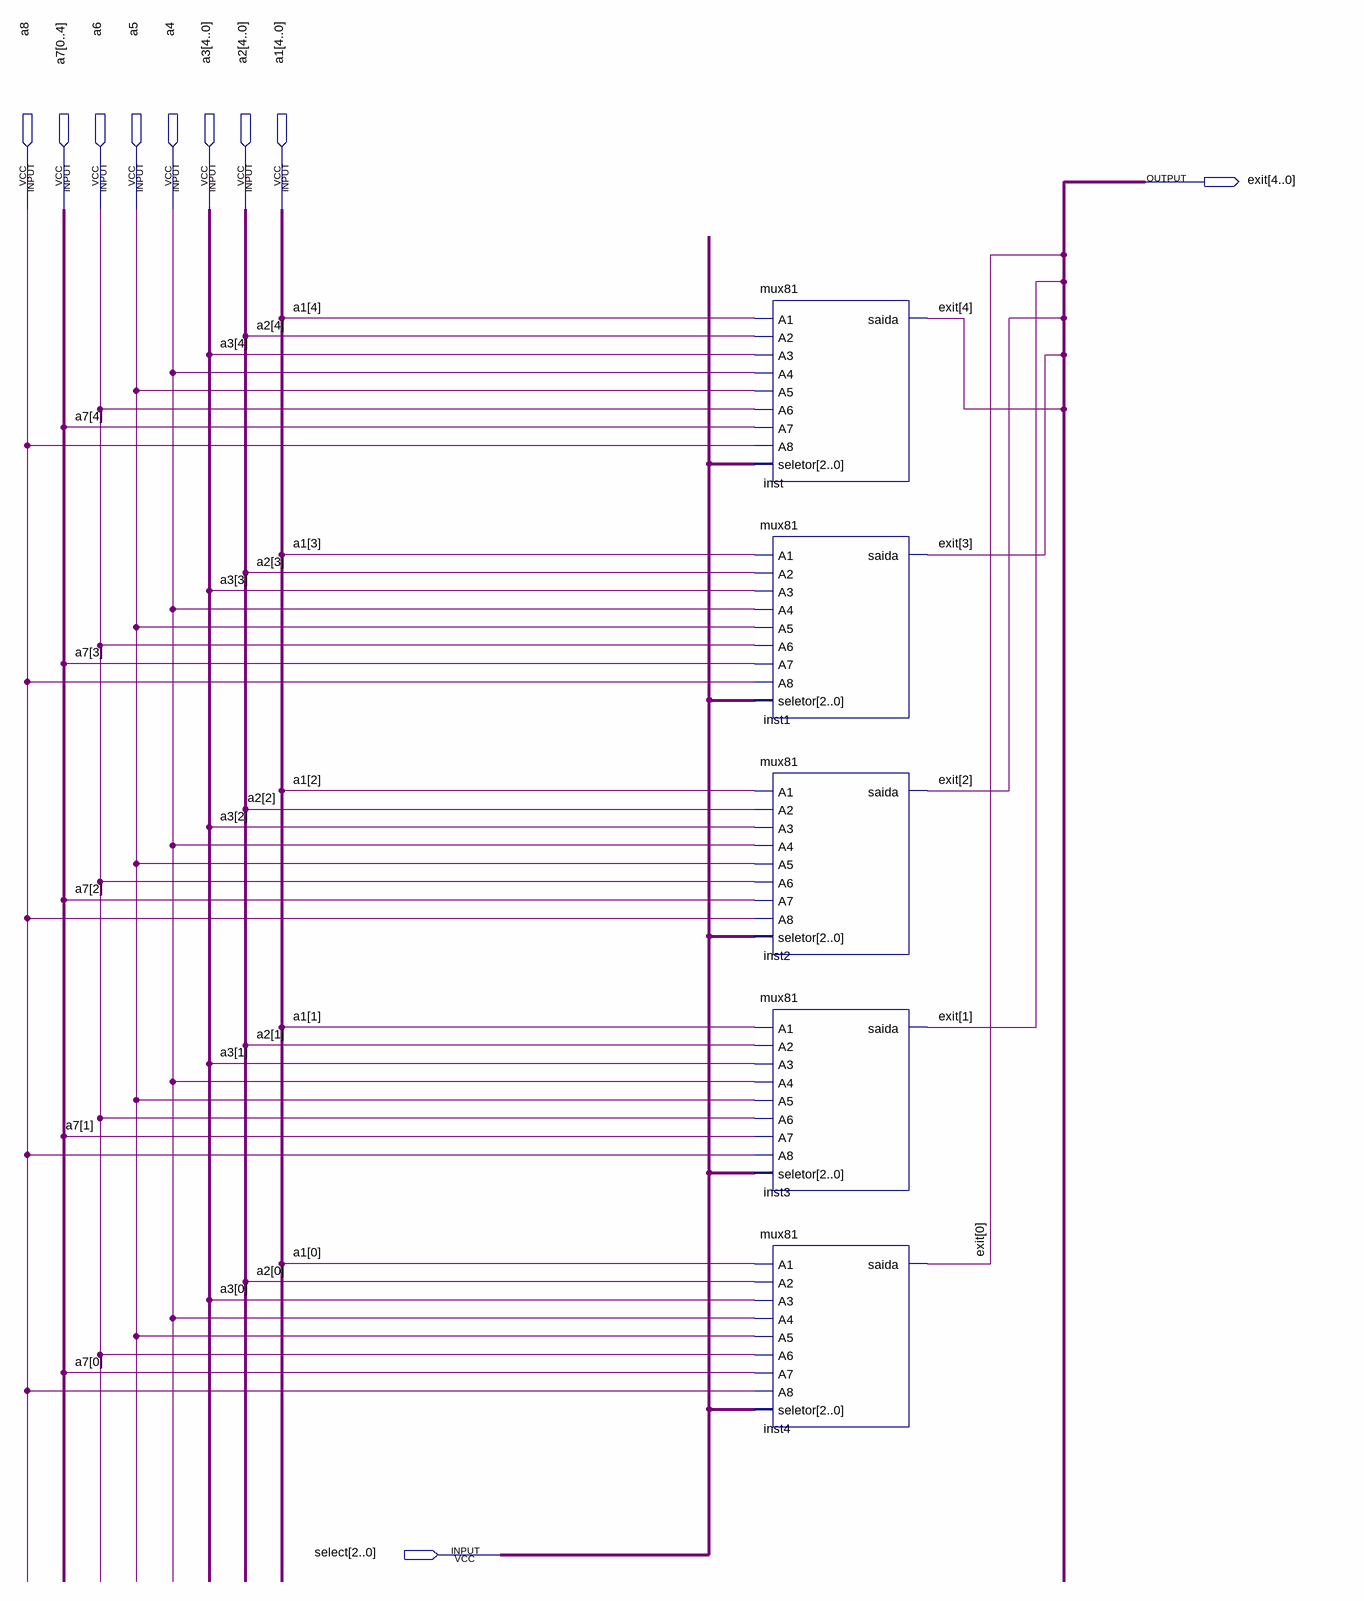
[diagram p0: schematic sheet]
// Quartus schematic mux815bit.bdf as structural Verilog: 5 symbols, 10 pins
module mux815bit (
  input  a8,
  input  [0:4] a7,
  input  a6,
  input  a5,
  input  a4,
  input  [4:0] a3,
  input  [4:0] a2,
  input  [4:0] a1,
  input  [2:0] select,
  output [4:0] exit
);

  mux81 inst (
    .A1(a1[4]), .A2(a2[4]), .A3(a3[4]), .A4(a4), .A5(a5), .A6(a6), .A7(a7[4]), .A8(a8), .seletor(select),
    .saida(exit[4]));
  mux81 inst1 (
    .A1(a1[3]), .A2(a2[3]), .A3(a3[3]), .A4(a4), .A5(a5), .A6(a6), .A7(a7[3]), .A8(a8), .seletor(select),
    .saida(exit[3]));
  mux81 inst2 (
    .A1(a1[2]), .A2(a2[2]), .A3(a3[2]), .A4(a4), .A5(a5), .A6(a6), .A7(a7[2]), .A8(a8), .seletor(select),
    .saida(exit[2]));
  mux81 inst3 (
    .A1(a1[1]), .A2(a2[1]), .A3(a3[1]), .A4(a4), .A5(a5), .A6(a6), .A7(a7[1]), .A8(a8), .seletor(select),
    .saida(exit[1]));
  mux81 inst4 (
    .A1(a1[0]), .A2(a2[0]), .A3(a3[0]), .A4(a4), .A5(a5), .A6(a6), .A7(a7[0]), .A8(a8), .seletor(select),
    .saida(exit[0]));
endmodule
